# EAGLE design TAStm32_v4 (EAGLE 9.6.2)
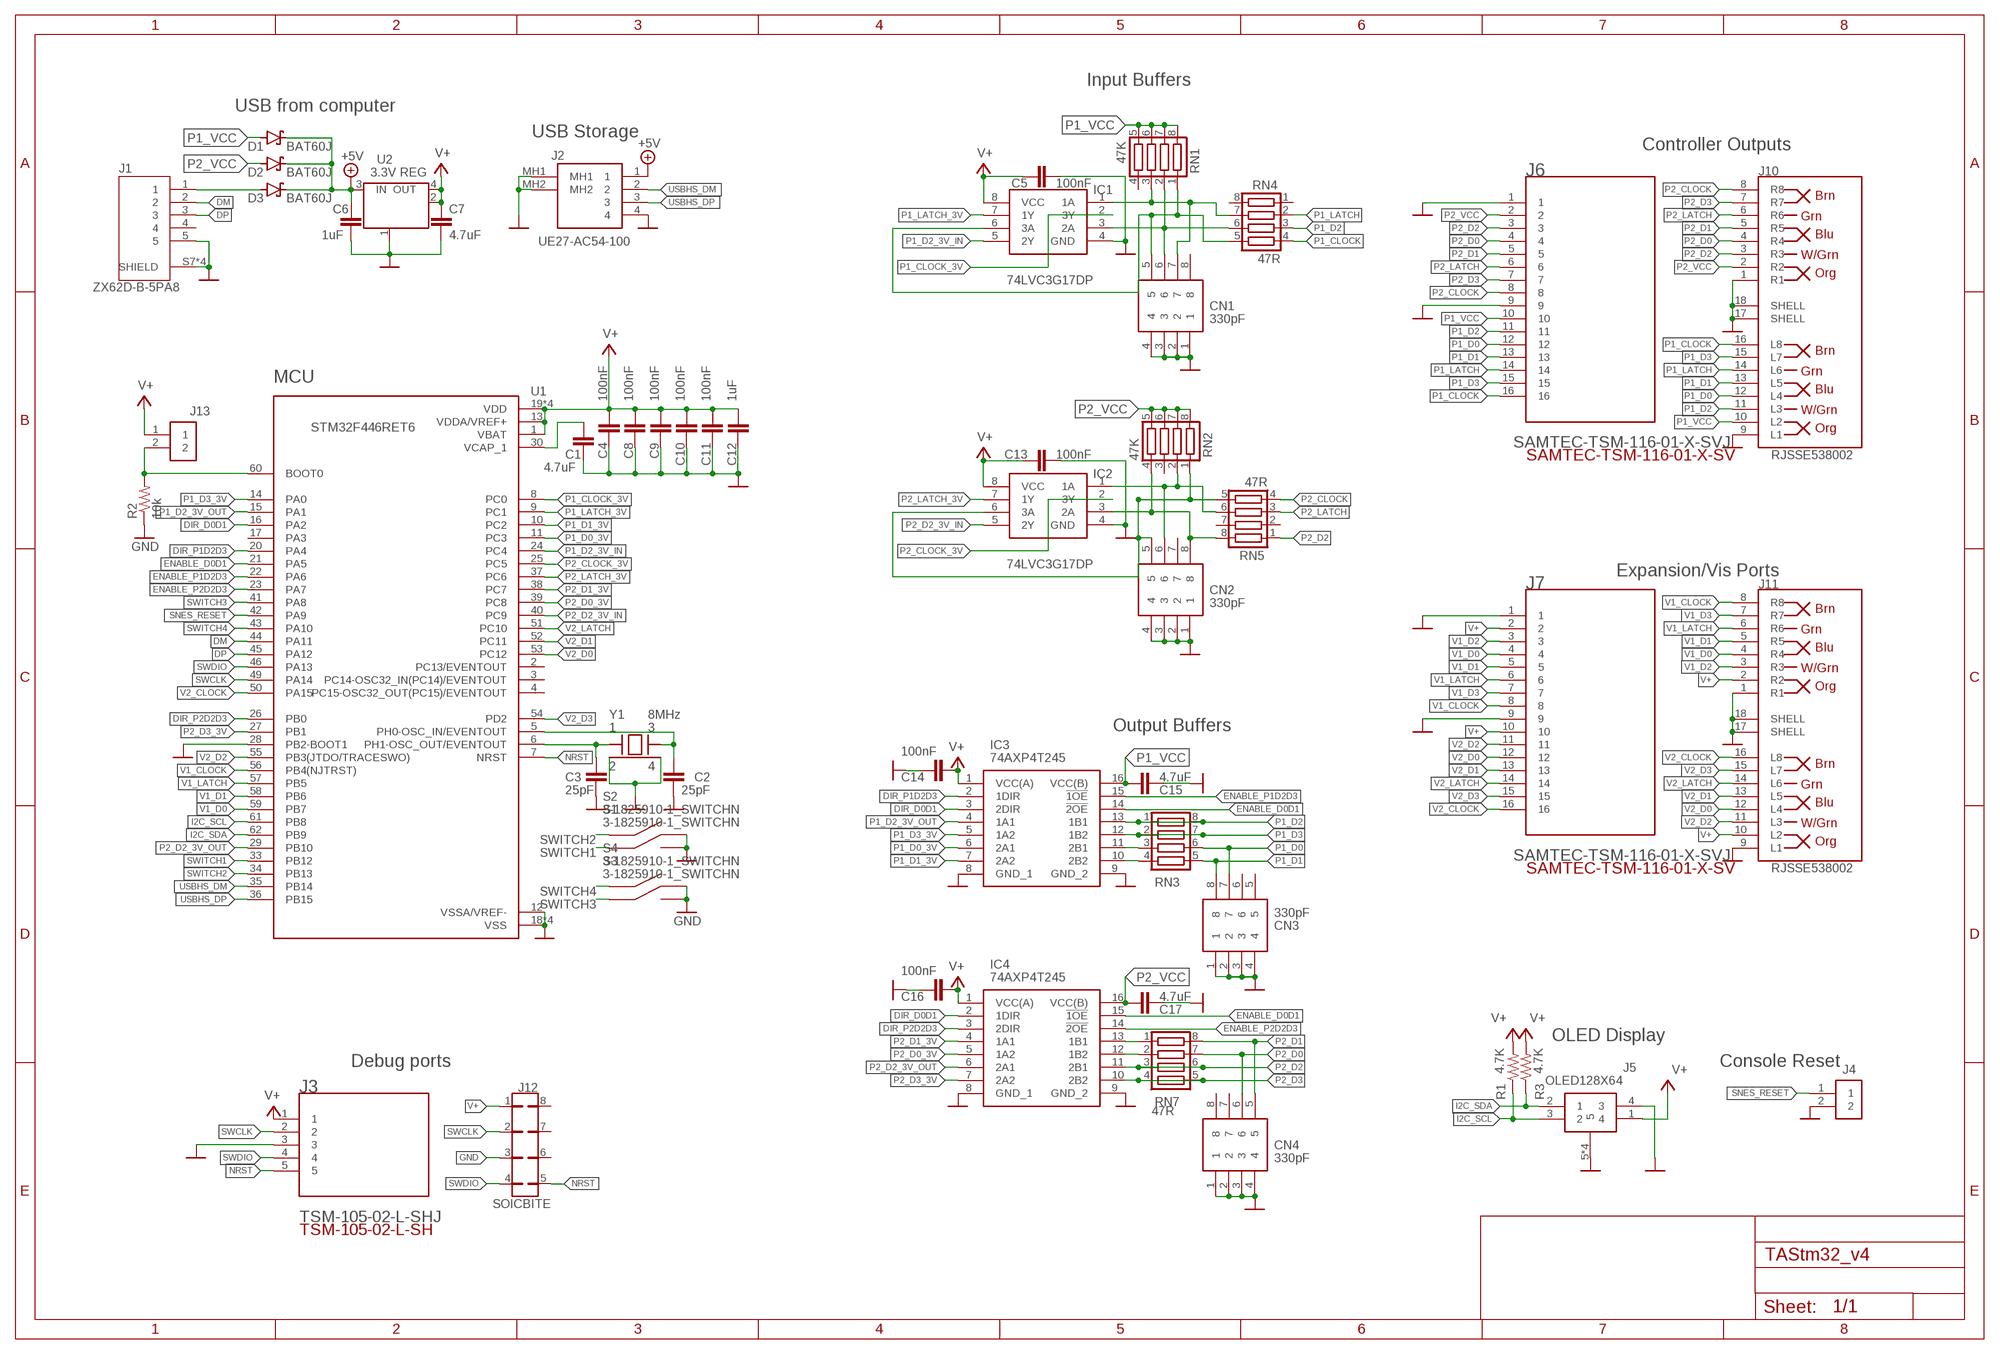
[diagram p0: schematic, sheet 1]

## Parts
C1  4.7uF  C-EUC0603K  [C0603K]
C2  25pF  C-EUC0603K  [C0603K]
C3  25pF  C-EUC0603K  [C0603K]
C4  100nF  C-EUC0603K  [C0603K]
C5  100nF  C-EUC0603K  [C0603K]
C6  1uF  C-EUC0603K  [C0603K]
C7  4.7uF  C-EUC0603K  [C0603K]
C8  100nF  C-EUC0603K  [C0603K]
C9  100nF  C-EUC0603K  [C0603K]
C10  100nF  C-EUC0603K  [C0603K]
C11  100nF  C-EUC0603K  [C0603K]
C12  1uF  C-EUC0603K  [C0603K]
C13  100nF  C-EUC0603K  [C0603K]
C14  100nF  C-EUC0603K  [C0603K]
C15  4.7uF  C-EUC0603K  [C0603K]
C16  100nF  C-EUC0603K  [C0603K]
C17  4.7uF  C-EUC0603K  [C0603K]
CN1  330pF  CA0612KRX7R7BB104  [CA0612KRX7R7BB104]
CN2  330pF  CA0612KRX7R7BB104  [CA0612KRX7R7BB104]
CN3  330pF  CA0612KRX7R7BB104  [CA0612KRX7R7BB104]
CN4  330pF  CA0612KRX7R7BB104  [CA0612KRX7R7BB104]
D1  BAT60J  DIODE_BAT60J  [DIODE_SOD323_ST]
D2  BAT60J  DIODE_BAT60J  [DIODE_SOD323_ST]
D3  BAT60J  DIODE_BAT60J  [DIODE_SOD323_ST]
IC1  74LVC3G17DP  74HCT3G07DP-Q100H  [SOP65P400X110-8N]
IC2  74LVC3G17DP  74HCT3G07DP-Q100H  [SOP65P400X110-8N]
IC3  74AXP4T245  74AVCH4T245PW,118  [SOP65P640X110-16N]
IC4  74AXP4T245  74AVCH4T245PW,118  [SOP65P640X110-16N]
J1  ZX62D-B-5PA8  [HIROSE_ZX62D-B-5PA8]
J2  UE27-AC54-100  [UE27AC54100]
J3  TSM-105-02-L-SHJ  [TSM-105-02-L-SH]
J4  CONSOLE_RESET  SAMTEC-TSM-102-01-X-SH_SAMTEC-TSM-102-01-X-SH  [SAMTEC-TSM-102-01-X-SH]
J5  OLED128X64  [OLED]
J6  SAMTEC-TSM-116-01-X-SVJ  [SAMTEC-TSM-116-01-X-SV]
J7  SAMTEC-TSM-116-01-X-SVJ  [SAMTEC-TSM-116-01-X-SV]
J10  RJSSE538002  RJSSE538002_RJSSE538002  [AMPHENOL_RJSSE538002]
J11  RJSSE538002  RJSSE538002_RJSSE538002  [AMPHENOL_RJSSE538002]
J12  SOICBITE  [SOICBITE]
J13  CONSOLE_RESET  SAMTEC-TSM-102-01-X-SH_SAMTEC-TSM-102-01-X-SH  [SAMTEC-TSM-102-01-X-SH]
R1  4.7K  R-US_R0805  [R0805]
R2  10k  R-US_R0805  [R0805]
R3  4.7K  R-US_R0805  [R0805]
RN1  47K  CTS742C083  [CTS742C083]
RN2  47K  CTS742C083  [CTS742C083]
RN3  CTS742C083  [CTS742C083]
RN4  47R  CTS742C083  [CTS742C083]
RN5  47R  CTS742C083  [CTS742C083]
RN7  47R  CTS742C083  [CTS742C083]
S1  3-1825910-1_SWITCHN  [3-1825910-1_318259101]
S2  3-1825910-1_SWITCHN  [3-1825910-1_318259101]
S3  3-1825910-1_SWITCHN  [3-1825910-1_318259101]
S4  3-1825910-1_SWITCHN  [3-1825910-1_318259101]
U1  STM32F446RET6  STM32F446RET7  [QFP50P1200X1200X160-64N]
U2  3.3V REG  MC33269ST-3.3T3  [SOT223]
Y1  8MHz  ABMM-8.000MHZ-B2-T_ABMM-8.000MHZ-B2-T  [DFN-4]

## Nets
+5V [power]: C6.2 D1.C D2.C D3.C J2.1 U2.3(IN)
BOOT0: J13.2 R2.2 U1.60(BOOT0)
DIR_D0D1: IC3.3(2DIR) IC4.2(1DIR) U1.16(PA2)
DIR_P1D2D3: IC3.2(1DIR) U1.20(PA4)
DIR_P2D2D3: IC4.3(2DIR) U1.26(PB0)
DM [USB]: J1.2 U1.44(PA11)
DP [USB]: J1.3 U1.45(PA12)
ENABLE_D0D1: IC3.14(!2OE) IC4.15(!1OE) U1.21(PA5)
ENABLE_P1D2D3: IC3.15(!1OE) U1.22(PA6)
ENABLE_P2D2D3: IC4.14(!2OE) U1.23(PA7)
GND: C1.2 C2.1 C3.1 C4.1 C5.2 C6.1 C7.1 C8.1 C9.1 C10.1 C11.1 C12.1 C13.2 C14.1 C15.2 C16.1 C17.2 CN1.1 CN1.2 CN1.3 CN1.4 CN2.1 CN2.2 CN2.3 CN2.4 CN3.1 CN3.2 CN3.3 CN3.4 CN4.1 CN4.2 CN4.3 CN4.4 IC1.4(GND) IC2.4(GND) IC3.8(GND_1) IC3.9(GND_2) IC4.8(GND_1) IC4.9(GND_2) J1.5 J1.S7(SHIELD) J1.S8(SHIELD) J1.S9(SHIELD) J1.S10(SHIELD) J2.4 J2.MH1 J2.MH2 J3.3 J4.2 J5.4 J5.5 J5.6 J5.7 J5.8 J6.1 J6.9 J7.1 J7.9 J10.1(R1) J10.9(L1) J10.17(SHELL) J10.18(SHELL) J11.1(R1) J11.9(L1) J11.17(SHELL) J11.18(SHELL) J12.3 R2.1 S1.3 S1.4 S2.3 S2.4 S3.3 S3.4 S4.3 S4.4 U1.12(VSSA/VREF-) U1.18(VSS) U1.28(PB2-BOOT1) U1.31(VSS) U1.47(VSS) U1.63(VSS) U2.1(GND/ADJ) Y1.2 Y1.4
I2C_SCL: J5.3 R1.1 U1.61(PB8)
I2C_SDA: J5.2 R3.1 U1.62(PB9)
N$1: D3.A J1.1
N$4: CN2.6 IC2.1(1A) RN2.2 RN5.6
N$5: C3.2 U1.6(PH1-OSC_OUT/EVENTOUT) Y1.1
N$6: CN2.5 IC2.6(3A) RN2.1 RN5.5
N$8: CN2.8 IC2.3(2A) RN2.4 RN5.8
N$9: IC3.11(2B1) RN3.3
N$10: IC3.10(2B2) RN3.4
N$11: IC4.12(1B2) RN7.2
N$12: IC4.13(1B1) RN7.1
N$16: CN1.7 IC1.1(1A) RN1.3 RN4.7
N$17: CN1.5 IC1.6(3A) RN1.1 RN4.5
N$18: CN1.6 IC1.3(2A) RN1.2 RN4.6
NRST: J3.5 J12.5 U1.7(NRST)
P1_CLOCK: J6.16 J10.16(L8) RN4.4
P1_CLOCK_3V: IC1.2(3Y) U1.8(PC0)
P1_D0: CN3.7 J6.12 J10.12(L4) RN3.6
P1_D0_3V: IC3.6(2A1) U1.11(PC3)
P1_D1: CN3.8 J6.13 J10.13(L5) RN3.5
P1_D1_3V: IC3.7(2A2) U1.10(PC2)
P1_D2: IC3.13(1B1) J6.11 J10.11(L3) RN3.1 RN3.8 RN4.3
P1_D2_3V_IN: IC1.5(2Y) U1.24(PC4)
P1_D2_3V_OUT: IC3.4(1A1) U1.15(PA1)
P1_D3: IC3.12(1B2) J6.15 J10.15(L7) RN3.2 RN3.7
P1_D3_3V: IC3.5(1A2) U1.14(PA0)
P1_LATCH: J6.14 J10.14(L6) RN4.2
P1_LATCH_3V: IC1.7(1Y) U1.9(PC1)
P1_VCC [power]: C15.1 D1.A IC3.16(VCC(B)) J6.10 J10.10(L2) RN1.5 RN1.6 RN1.7 RN1.8
P2_CLOCK: J6.8 J10.8(R8) RN5.4
P2_CLOCK_3V: IC2.2(3Y) U1.25(PC5)
P2_D0: CN4.6 J6.4 J10.4(R4) RN7.7
P2_D0_3V: IC4.5(1A2) U1.39(PC8)
P2_D1: CN4.5 J6.5 J10.5(R5) RN7.8
P2_D1_3V: IC4.4(1A1) U1.38(PC7)
P2_D2: IC4.11(2B1) J6.3 J10.3(R3) RN5.1 RN7.3 RN7.6
P2_D2_3V_IN: IC2.5(2Y) U1.40(PC9)
P2_D2_3V_OUT: IC4.6(2A1) U1.29(PB10)
P2_D3: IC4.10(2B2) J6.7 J10.7(R7) RN7.4 RN7.5
P2_D3_3V: IC4.7(2A2) U1.27(PB1)
P2_LATCH: J6.6 J10.6(R6) RN5.3
P2_LATCH_3V: IC2.7(1Y) U1.37(PC6)
P2_VCC [power]: C17.1 D2.A IC4.16(VCC(B)) J6.2 J10.2(R2) RN2.5 RN2.6 RN2.7 RN2.8
SNES_RESET: J4.1 U1.42(PA9)
SWCLK: J3.2 J12.2 U1.49(PA14)
SWDIO: J3.4 J12.4 U1.46(PA13)
SWITCH1: S1.1 S1.2 U1.33(PB12)
SWITCH2: S2.1 S2.2 U1.34(PB13)
SWITCH3: S3.1 S3.2 U1.41(PA8)
SWITCH4: S4.1 S4.2 U1.43(PA10)
USBHS_DM [USB]: J2.2 U1.35(PB14)
USBHS_DP [USB]: J2.3 U1.36(PB15)
V1_CLOCK: J7.8 J11.8(R8) U1.56(PB4(NJTRST))
V1_D0: J7.4 J11.4(R4) U1.59(PB7)
V1_D1: J7.5 J11.5(R5) U1.58(PB6)
V1_D2: J7.3 J11.3(R3)
V1_D3: J7.7 J11.7(R7)
V1_LATCH: J7.6 J11.6(R6) U1.57(PB5)
V2_CLOCK: J7.16 J11.16(L8) U1.50(PA15)
V2_D0: J7.12 J11.12(L4) U1.53(PC12)
V2_D1: J7.13 J11.13(L5) U1.52(PC11)
V2_D2: J7.11 J11.11(L3) U1.55(PB3(JTDO/TRACESWO))
V2_D3: J7.15 J11.15(L7) U1.54(PD2)
V2_LATCH: J7.14 J11.14(L6) U1.51(PC10)
V+ [power]: C4.2 C5.1 C7.2 C8.2 C9.2 C10.2 C11.2 C12.2 C13.1 C14.2 C16.2 IC1.8(VCC) IC2.8(VCC) IC3.1(VCC(A)) IC4.1(VCC(A)) J3.1 J5.1 J7.2 J7.10 J11.2(R2) J11.10(L2) J12.1 J13.1 R1.2 R3.2 U1.1(VBAT) U1.13(VDDA/VREF+) U1.19(VDD) U1.32(VDD) U1.48(VDD) U1.64(VDD) U2.2(OUT) U2.4(OUT)
VCAP: C1.1 U1.30(VCAP_1)
XTAL1: C2.2 U1.5(PH0-OSC_IN/EVENTOUT) Y1.3
Unconnected: CN1.8 CN2.7 CN3.5 CN3.6 CN4.7 CN4.8 J1.4 J12.6 J12.7 J12.8 RN1.4 RN2.3 RN4.1 RN4.8 RN5.2 RN5.7 U1.2(PC13/EVENTOUT) U1.3(PC14-OSC32_IN(PC14)/EVENTOUT) U1.4(PC15-OSC32_OUT(PC15)/EVENTOUT) U1.17(PA3)

## Notes on the sheet
- Input Buffers
- USB from computer
- USB Storage
- Controller Outputs
- MCU
- Expansion/Vis Ports
- Output Buffers
- OLED Display
- Debug ports | Console Reset

## Library data of the parts
C1-C17 = rcl:C-EU: CAPACITOR, European symbol; SPICEPREFIX: C
CN1-CN4 = SamacSys_Parts:CA0612KRX7R7BB104: Phycomp Capacitor Array 100nF 16V dc +/-10% 4-way X7R Dielectric 0612 (1632M) Package C-Array Series Surface Mount Source: Datasheet; DESCRIPTION: Phycomp Capacitor Array 100nF 16V dc +/-10% 4-way X7R Dielectric 0612 (1632M) Package C-Array Series Surface Mount; HEIGHT: 0mm; MANUFACTURER_NAME: YAGEO (PHYCOMP); MANUFACTURER_PART_NUMBER: CA0612KRX7R7BB104; MOUSER_PART_NUMBER: 603-CA612KRX7R7BB104; MOUSER_PRICE-STOCK: https://www.mouser.co.uk/ProductDetail/Yageo/CA0612KRX7R7BB104/?qs=AJwqpy2c0%252B9CH0DBF0MBBw%3D%3D
D1-D3 = TAStm32_v4:DIODE_BAT60J: Schottky barrier diode Source: www.st.com, BAT60J.pdf
IC1 IC2 = SamacSys_Parts:74HCT3G07DP-Q100H: 74HC(T)3G07-Q100 - Triple buffer with open-drain outputs@en-us Source: Datasheet; DESCRIPTION: 74HC(T)3G07-Q100 - Triple buffer with open-drain outputs@en-us; HEIGHT: 1.1mm; MANUFACTURER_NAME: Nexperia; MANUFACTURER_PART_NUMBER: 74HCT3G07DP-Q100H; RS_PART_NUMBER: 1532947P; RS_PRICE-STOCK: http://uk.rs-online.com/web/p/products/1532947P
IC3 IC4 = SamacSys_Parts:74AVCH4T245PW,118: 74AVCH4T245 - 4-bit dual supply translating transceiver with configurable voltage translation; 3-state@en-us Source: Datasheet; DESCRIPTION: 74AVCH4T245 - 4-bit dual supply translating transceiver with configurable voltage translation; 3-state@en-us; HEIGHT: 1.1mm; MANUFACTURER_NAME: Nexperia; MANUFACTURER_PART_NUMBER: 74AVCH4T245PW,118; MOUSER_PART_NUMBER: 771-74AVCH4T245PW118; MOUSER_PRICE-STOCK: http://www.mouser.com/Search/ProductDetail.aspx?qs=jquClx72t9DzXyE70aWLyQ%3d%3d
J1 = ZX62D-B-5PA8:ZX62D-B-5PA8: CONN RCPT USB; AVAILABILITY: Unavailable; DESCRIPTION: 5 Pin Single Port USB 2.0 Micro B Bottom Mount Through Hole Receptacle Male; MF: Hirose; MP: ZX62D-B-5PA8; PACKAGE: None; PRICE: None
J2 = SamacSys_Parts:UE27-AC54-100: USB Connectors 4P R/A PCB Recpt Source: Datasheet; DESCRIPTION: USB Connectors 4P R/A PCB Recpt; HEIGHT: 6.9mm; MANUFACTURER_NAME: Amphenol; MANUFACTURER_PART_NUMBER: UE27-AC54-100; MOUSER_PART_NUMBER: 523-UE27-AC54-100; MOUSER_PRICE-STOCK: https://www.mouser.co.uk/ProductDetail/Amphenol-Commercial-Products/UE27-AC54-100?qs=rJxDu3iMzY11Oq3QSy%252BXOA%3D%3D
J3 = TSM-105-02-L-SH:TSM-105-02-L-SH: Check prices; AVAILABILITY: Bad; DESCRIPTION: Connector Header Surface Mount, Right Angle 5 position 0.100 (2.54mm); MF: Samtec; MP: TSM-105-02-L-SH; PACKAGE: None; PRICE: None; PURCHASE-URL: https://pricing.snapeda.com/search/part/TSM-105-02-L-SH/?ref=eda
J4 J13 = TAStm32_v4:SAMTEC-TSM-102-01-X-SH_SAMTEC-TSM-102-01-X-SH
J5 = TAStm32_v4:OLED128X64
J6 J7 = SAMTEC-TSM-116-01-X-SV:SAMTEC-TSM-116-01-X-SV
J10 J11 = TAStm32_v4:RJSSE538002_RJSSE538002: Conn RJ-45 F 16 POS 1.27mm Solder RA SMD 16 Terminal 2 Port Cat 5
J12 = SOICbite_Eagle:SOICBITE: SOICbite footprint Allows for direct clipping of a SOIC-8 Testclip onto a PCB edge for Programming/Debugging purposes without extra components. Original footprint created by: Simon Merrit Adapted to Eagle by: Chiel Voswijk (Foxhood) NOTE: Footprint is to be used on the edge of a PCB and may require the use of thin traces for accessing the inner pads. This may violate some Design Rules! One can often ignore these, but understand working is NOT guaranteed.
R1-R3 = rcl:R-US_: RESISTOR, American symbol; SPICEPREFIX: R
RN1-RN5 RN7 = resistor-net:CTS742C083: Chip Resistor Array 4 Single Resistor Source: http://www.ctscorp.com/components/Datasheets/CTSChipArrayDs.pdf; OC_FARNELL: unknown; OC_NEWARK: unknown
S1-S4 = TAStm32_v4:3-1825910-1_SWITCHN
U1 = STM32F446RET6:STM32F446RET7
U2 = linear:MC33269ST*: Adjustable Output Low Dropout Voltage Regulator 800 mA Source: http://www.onsemi.com/pub/Collateral/MC33269-D.PDF
Y1 = TAStm32_v4:ABMM-8.000MHZ-B2-T_ABMM-8.000MHZ-B2-T: CRYSTAL 24MHZ 18PF SMD

## Net classes
1 USB: width 0.254 mm, clearance 0.152 mm

## Board
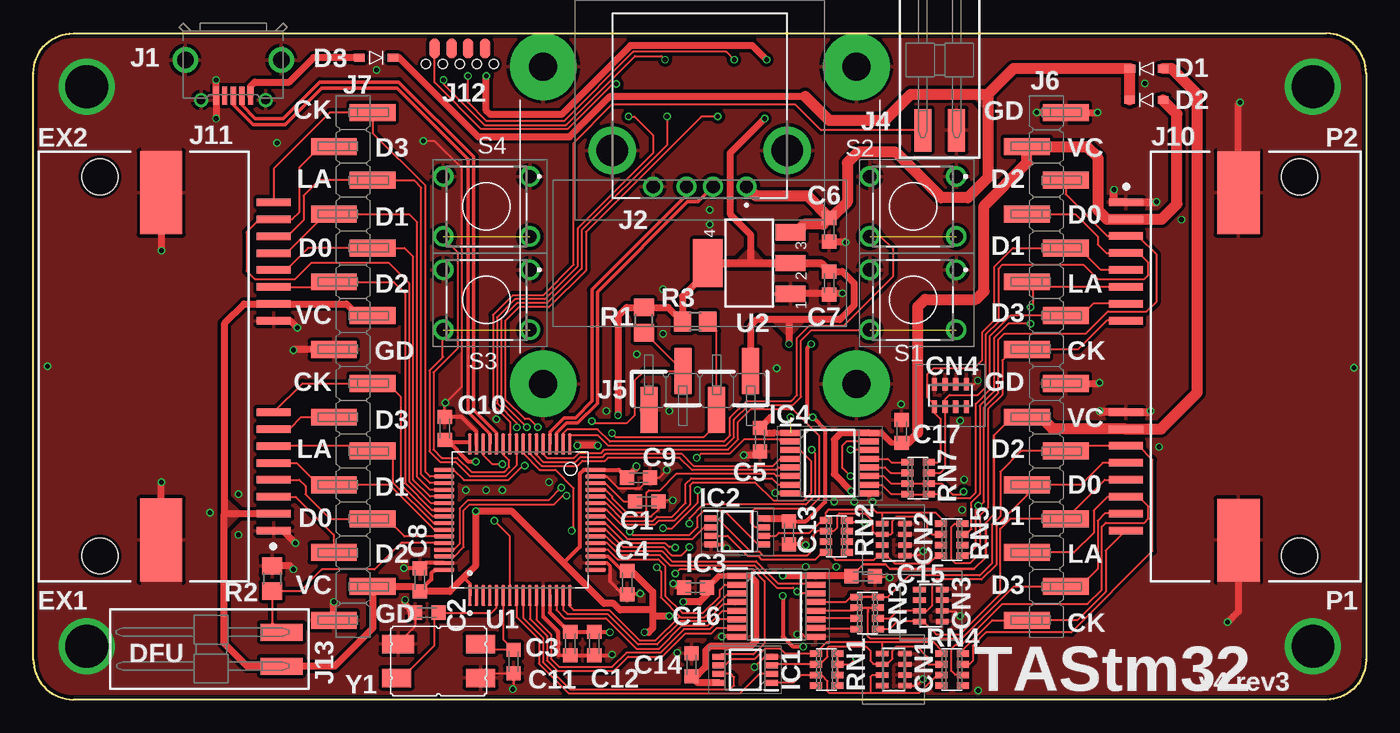
[diagram p1: board, top side]
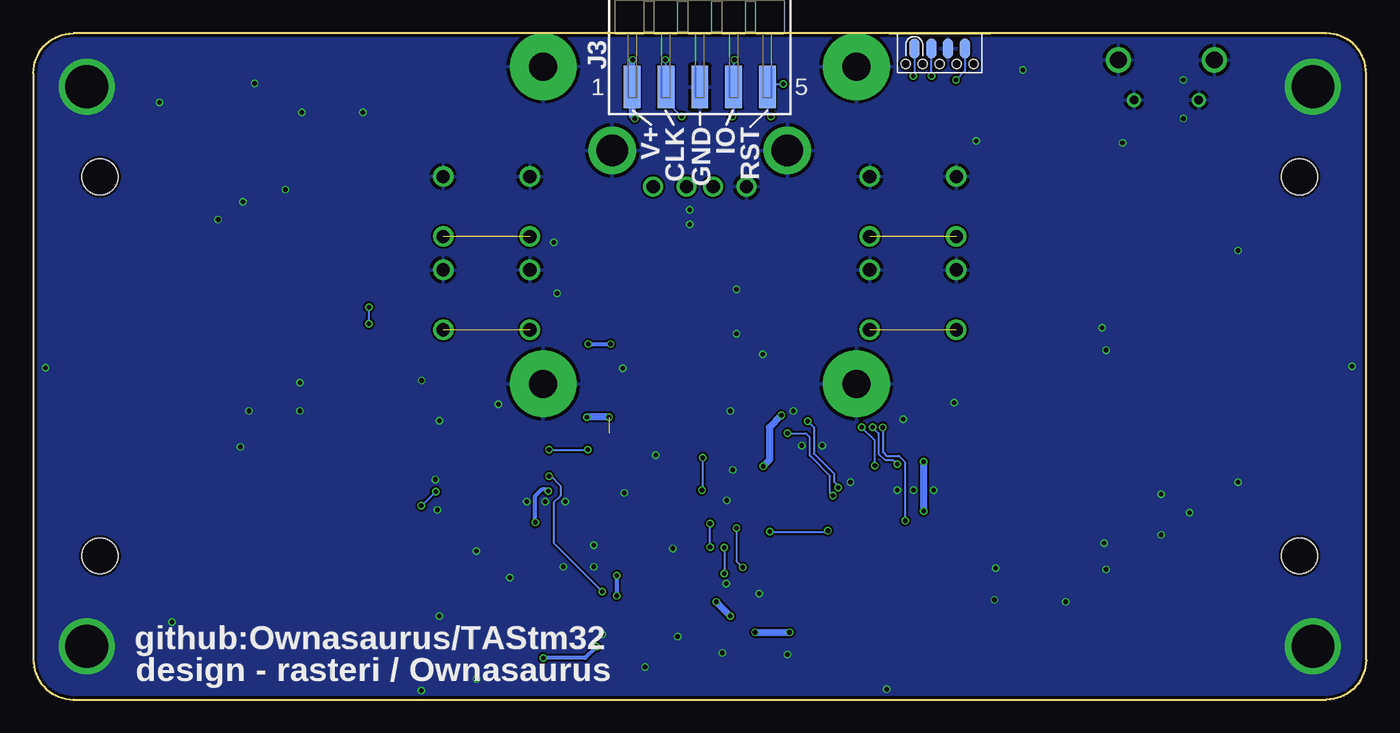
[diagram p2: board, bottom side, seen from below]

Size 100 x 50 mm. Coordinates in mm from the lower left corner, seen from the top.
Outline: 3,50 97,50 arc-90 100,47 100,3 arc-90 97,0 3,0 arc-90 0,3 0,47 arc-90 3,50
Copper layers (1*16): Top 0.035mm / dielectric 1.53mm / Bottom 0.035mm
Design rules "circuithub-minimum-design-rules-with-tented-vias *": minimum track width 3mil, minimum drill 0.15mm, track to track 6mil, track to pad 6mil, pad to pad 6mil, via to via 6mil, smd to smd 0mil, copper to edge 8mil, drill to drill 8mil, minimum pad ring 4mil, minimum via ring 4mil, stop-mask expansion 4mil, vias tented up to drill 25mil, thermal gap 10mil

### Footprints (pad centres in the part's own frame; a part is rotated, then mirrored left to right if it is on the bottom)
C0603K = smd 1.05 x 1.08: 1 -0.875,0; 2 0.875,0
CA0612KRX7R7BB104 = smd 0.95 x 0.4: 1 -0.85,1.2; 2 -0.85,0.4; 3 -0.85,-0.4; 4 -0.85,-1.2; 5 0.85,-1.2; 6 0.85,-0.4; 7 0.85,0.4; 8 0.85,1.2
DIODE_SOD323_ST = smd 0.8 x 0.6: A 1.25,0; C -1.25,0
SOP65P400X110-8N = smd 0.95 x 0.45: 1 -1.975,0.975; 2 -1.975,0.325; 3 -1.975,-0.325; 4 -1.975,-0.975; 5 1.975,-0.975; 6 1.975,-0.325; 7 1.975,0.325; 8 1.975,0.975
SOP65P640X110-16N = smd 1.475 x 0.45: 1 -2.938,2.275; 2 -2.938,1.625; 3 -2.938,0.975; 4 -2.938,0.325; 5 -2.938,-0.325; 6 -2.938,-0.975; 7 -2.938,-1.625; 8 -2.938,-2.275; 9 2.938,-2.275; 10 2.938,-1.625; 11 2.938,-0.975; 12 2.938,-0.325; 13 2.938,0.325; 14 2.938,0.975; 15 2.938,1.625; 16 2.938,2.275
HIROSE_ZX62D-B-5PA8 = smd 1.35 x 0.4: 1 2.675,1.3; 2 2.675,0.65; 3 2.675,0; 4 2.675,-0.65; 5 2.675,-1.3 | drill 0.65 pad 1.05: S7 3,2.425; S8 3,-2.425 | drill 1.25 pad 1.9: S9 0,3.6; S10 0,-3.6
UE27AC54100 = drill 1 pad 1.5: 1 -3.5,0; 2 -1,0; 3 1,0; 4 3.5,0 | drill 2.38 pad 3.57: MH1 -6.57,-2.71; MH2 6.57,-2.71
TSM-105-02-L-SH = smd 1.27 x 3.18: 1 -5.08,-5.283; 2 -2.54,-5.283; 3 0,-5.283; 4 2.54,-5.283; 5 5.08,-5.283
SAMTEC-TSM-102-01-X-SH = smd 1.27 x 3.18: 1 -1.27,-5.283; 2 1.27,-5.283
OLED = smd 1.27 x 3.43: 1 -3.81,8.84; 2 -1.27,11.76; 3 1.27,8.84; 4 3.81,11.76 | drill 2.1 pad 5: 5 -11.75,9.8; 6 11.75,9.8; 7 -11.75,-14; 8 11.75,-14
SAMTEC-TSM-116-01-X-SV = smd 1.27 x 3.43: 1 -19.05,1.46; 2 -16.51,-1.46; 3 -13.97,1.46; 4 -11.43,-1.46; 5 -8.89,1.46; 6 -6.35,-1.46; 7 -3.81,1.46; 8 -1.27,-1.46; 9 1.27,1.46; 10 3.81,-1.46; 11 6.35,1.46; 12 8.89,-1.46; 13 11.43,1.46; 14 13.97,-1.46; 15 16.51,1.46; 16 19.05,-1.46
AMPHENOL_RJSSE538002 = smd 0.56 x 2.54: 1 12.325,13.04; 2 11.055,13.04; 3 9.785,13.04; 4 8.515,13.04; 5 7.245,13.04; 6 5.975,13.04; 7 4.705,13.04; 8 3.435,13.04; 9 -3.425,13.04; 10 -4.695,13.04; 11 -5.965,13.04; 12 -7.235,13.04; 13 -8.505,13.04; 14 -9.775,13.04; 15 -11.045,13.04; 16 -12.315,13.04 | smd 6.22 x 3.18: 17 -13.035,4.59; 18 13.025,4.59 | hole 2.69: -14.225,0; 14.225,0
SOICBITE = smd 0.8 x 1.5: 1 1.905,0.75; 2 0.635,0.75; 3 -0.635,0.75; 4 -1.905,0.75 | smd 0.8 x 1.5 bottom: 5 -1.905,0.75; 6 -0.635,0.75; 7 0.635,0.75; 8 1.905,0.75 | hole 0.7: -2.54,1.905; -1.27,1.905; 0,1.905; 1.27,1.905; 2.54,1.905
R0805 = smd 1.3 x 1.5: 1 -0.95,0; 2 0.95,0
CTS742C083 = smd 0.5 x 0.9: 1 -1.2,-0.8; 2 -0.4,-0.8; 3 0.4,-0.8; 4 1.2,-0.8; 5 1.2,0.8; 6 0.4,0.8; 7 -0.4,0.8; 8 -1.2,0.8
3-1825910-1_318259101 = drill 0.99 pad 1.54: 1 3.25,-2.25; 2 -3.25,-2.25; 3 3.25,2.25; 4 -3.25,2.25
QFP50P1200X1200X160-64N = smd 1.56 x 0.28: 1 -5.68,3.75; 2 -5.68,3.25; 3 -5.68,2.75; 4 -5.68,2.25; 5 -5.68,1.75; 6 -5.68,1.25; 7 -5.68,0.75; 8 -5.68,0.25; 9 -5.68,-0.25; 10 -5.68,-0.75; 11 -5.68,-1.25; 12 -5.68,-1.75; 13 -5.68,-2.25; 14 -5.68,-2.75; 15 -5.68,-3.25; 16 -5.68,-3.75; 33 5.68,-3.75; 34 5.68,-3.25; 35 5.68,-2.75; 36 5.68,-2.25; 37 5.68,-1.75; 38 5.68,-1.25; 39 5.68,-0.75; 40 5.68,-0.25; 41 5.68,0.25; 42 5.68,0.75; 43 5.68,1.25; 44 5.68,1.75; 45 5.68,2.25; 46 5.68,2.75; 47 5.68,3.25; 48 5.68,3.75 | smd 0.28 x 1.56: 17 -3.75,-5.68; 18 -3.25,-5.68; 19 -2.75,-5.68; 20 -2.25,-5.68; 21 -1.75,-5.68; 22 -1.25,-5.68; 23 -0.75,-5.68; 24 -0.25,-5.68; 25 0.25,-5.68; 26 0.75,-5.68; 27 1.25,-5.68; 28 1.75,-5.68; 29 2.25,-5.68; 30 2.75,-5.68; 31 3.25,-5.68; 32 3.75,-5.68; 49 3.75,5.68; 50 3.25,5.68; 51 2.75,5.68; 52 2.25,5.68; 53 1.75,5.68; 54 1.25,5.68; 55 0.75,5.68; 56 0.25,5.68; 57 -0.25,5.68; 58 -0.75,5.68; 59 -1.25,5.68; 60 -1.75,5.68; 61 -2.25,5.68; 62 -2.75,5.68; 63 -3.25,5.68; 64 -3.75,5.68
SOT223 = smd 1.219 x 2.235: 1 -2.311,-3.099; 2 0,-3.099; 3 2.311,-3.099 | smd 3.6 x 2.2: 4 0,3.099
DFN-4 = smd 2.2 x 1.4: 1 0.45,1.32; 2 0.45,3.87; 3 6.75,3.87 | smd 2.4 x 1.4: 4 6.65,1.32

### Placement (x,y rotation side)
C1  46.02,14.87 0 top
C2  29.53,6.52 0 top
C3  36.03,2.84 90 top
C4  44.55,8.78 90 top
C5  54.52,19.51 270 top
C6  59.71,35.25 90 top
C7  59.71,31.25 90 top
C8  29,8.98 270 top
C9  45.4,16.65 180 top
C10  30.87,20.34 270 top
C11  40.29,4.2 90 top
C12  42.1,4.2 90 top
C13  56.69,12.51 270 top
C14  49.38,2.6 270 top
C15  62.25,9.25 0 top
C16  49.68,8.39 0 top
C17  65.15,20.12 90 top
CN1  64.54,2.25 180 top
CN2  64.54,12 180 top
CN3  67.33,7.05 180 top
CN4  68.8,22.82 270 top
D1  83.52,47.35 0 top
D2  83.5,45 0 top
D3  25.72,48.17 180 top
IC1  53.41,2.25 180 top
IC2  52.82,12.61 0 top
IC3  55.75,7 0 top
IC4  59.75,17.75 0 top
J1  15,48 270 top
J2  50,38.5 180 top
J3  50,51.25 0 bottom
J4  68,48 0 top
J5  50,33.5 180 top
J6  76,25 270 top
J7  24,25 90 top
J10  95,25 90 top
J11  5,25 270 top
J12  32,49.6 180 bottom
J13  13.35,3.78 90 top
R1  45.82,28.48 90 top
R2  17.9,9.08 270 top
R3  49.65,28.35 180 top
RN1  59.52,2.25 270 top
RN2  60.25,12.25 270 top
RN3  62.57,6.5 270 top
RN4  68.93,2.25 90 top
RN5  68.9,12 90 top
RN7  66.38,16.61 270 top
S1  66,30 0 top
S2  66,37 0 top
S3  34,30 0 top
S4  34,37 0 top
U1  36.5,13.49 90 top
U2  53.71,32.75 90 top
Y1  34,5.49 180 top

### Tracks (layer width: path | path; a pad name or v marks a point on that pad's centre or on a via)
+5V
  Top 0.508: D3.C 27.43,48.17 33.38,42.23 40.23,42.23 43.28,45.28 57.91,45.28 | 59.73,36.15 C6.2
  Top 0.61: 82.25,47.33 D1.C | 59.86,36.13 C6.2 59.25,35.67 | U2.3 57.27,35.06
  Top 0.813: D2.C 82.25,47.33 | D1.C 73.55,47.35 71.63,45.43 | 59.86,36.13 61.07,37.34 61.07,40.28 61.85,41.06 64.72,41.06 68.12,37.66 70.1,37.66 71.63,39.18 71.63,45.43 | 57.27,35.06 57.87,35.67 59.25,35.67 | J2.1 54.19,37.81 58.06,37.81 59.73,36.15 | 57.91,45.28 59.71,43.48 63.89,43.48 65.84,45.43 71.63,45.43
  pour Top (no thermals): 71.63,45.43 71.63,44.21 70.41,45.43
BOOT0
  Top 0.152: U1.60 27.58,11.74 25.6,9.77 21.64,9.77 20.01,8.13 R2.2 17.9,5.78 J13.2
DIR_D0D1  (via drill 0.35)
  Top 0.152: U1.16 40.25,6.99 40.52,6.72 43.21,6.72 45.5,4.43 46.67,4.43 48.43,6.18 48.57,6.18 | IC4.2 56.11,19.38 55.97,19.51 53.31,19.51 52.25,18.44 50.08,18.44 v49.78,18.14 | v46.79,9.92 47.09,9.61 47.09,7.66 48.57,6.18 | IC3.3 52.16,7.97 50.37,6.18 48.57,6.18 | v47.24,12.86 47.94,12.86 49.84,14.76 v49.84,15.71
  Bottom 0.152: v49.78,18.14 49.78,15.71 v49.84,15.71 | v47.24,12.86 47.24,10.38 v46.79,9.92
DIR_P1D2D3
  Top 0.152: U1.20 43.12,11.24 43.84,10.53 46.9,10.53 47.4,10.03 47.4,7.79 48.69,6.49 50.24,6.49 51.51,7.76 51.51,8.24 51.89,8.62 IC3.2
DIR_P2D2D3
  Top 0.152: U1.26 43.02,14.24 44.14,13.12 46.62,13.12 46.91,13.41 48.05,13.41 49.25,14.61 49.25,16.06 49.5,16.31 54.16,16.31 55.52,14.95 57.8,14.95 58.37,15.52 58.37,17.87 57.52,18.73 IC4.3
DM
  Top 0.254: J1.2 15.65,44.6 16.65,43.6 18.75,43.6 21.49,46.34 27.42,46.34 33.03,40.73 33.03,21.74 34.75,20.02 U1.44
DP
  Top 0.254: J1.3 15,44.63 16.49,43.14 18.9,43.14 21.64,45.88 27.3,45.88 32.63,40.56 32.63,21.57 34.27,19.93 34.27,19.19 U1.45
ENABLE_D0D1  (via drill 0.35)
  Top 0.152: U1.21 43.05,11.74 43.96,10.83 47.02,10.83 47.79,10.07 54.1,10.07 55.79,8.38 57.01,8.38 v57.3,8.09 57.42,7.97 IC3.14 | IC4.15 61.02,19.38 60.7,19.05 60.7,17.37 v61.31,16.77
  Bottom 0.152: v61.31,16.77 61.17,16.77 60.45,16.05 60.45,15.29 60.96,14.78 60.96,11.75 60.45,11.24 60.42,11.21 v57.3,8.09
ENABLE_P1D2D3
  Top 0.152: U1.22 42.98,12.24 44.09,11.14 47.15,11.14 47.91,10.38 54.23,10.38 55.92,8.69 58.63,8.69 IC3.15
ENABLE_P2D2D3  (via drill 0.35)
  Top 0.152: U1.23 42.95,12.74 44.25,11.44 47.28,11.44 47.89,10.83 48.63,10.83 v49.23,11.43 | v58.41,18.75 58.67,18.48 58.67,15.36 57.95,14.64 50.26,14.64 49.23,13.61 v49.23,13.2 | IC4.14 62.67,18.75 v61.31,18.75
  Bottom 0.152: v61.31,18.75 v58.41,18.75 | v49.23,11.43 v49.23,13.2
GND  (via drill 0.35, 3.2)
  Top 0.152: U1.28 42.88,15.24 44.4,13.73 46.36,13.73 46.89,14.26 C1.2 46.97,14.95 v47.99,14.95 | v47.53,17.23 46.95,16.65 C9.1 | C10.1 30.87,22.22 v30.92,22.26 32.16,23.5 32.16,39.87 30.1,41.92 v29.26,41.92 | Y1.2 33.9,1.97 C3.1 36.03,0.84 v35.97,0.78 | C2.1 28.66,5.48 Y1.4 | v64.25,9.16 63.18,9.16 63.12,9.21 C15.2 | v66.75,11.14 66.45,10.83 65.39,10.83 CN2.2 | v69.54,6.26 69.23,6.57 68.18,6.57 CN3.4 CN3.3 CN3.2 CN3.1 | IC3.9 57.92,4.72 57.76,4.89 v57.3,4.89 | IC3.8 52.8,4.74 | 51.73,11.63 v52.02,11.34 | CN2.4 CN2.3 CN2.2 | CN2.2 CN2.1 | CN4.4 CN4.3 CN4.2 | CN4.2 CN4.1 | CN4.2 70.59,23.67 v70.87,23.94 | CN1.4 CN1.3 CN1.2 CN1.1 66.25,1.05 v66.74,1.54 | IC1.4 54.89,3.23 v54.1,2.44
  Top 0.203: U1.31 43.01,16.74 43.9,15.86 45.48,15.86 C9.1
  Top 0.254: U1.12 38.25,6.24 | 39.39,3.32 C11.1 | 43.41,3.32 v43.41,3.37 | U1.18 43.05,10.24 43.26,10.03 43.26,8.85 44.2,7.91 C4.1 44.58,7.94 v45.55,7.94
  Top 0.305: U1.47 33.25,20.08 32.12,21.21 C10.1 | 39.39,3.32 39.35,3.37 39.35,5.13 38.25,6.24 | C11.1 C12.1 43.41,3.32 | U1.63 29.39,10.24 C8.1 v27.8,9.85 | C16.1 48.31,8.39 v48.01,8.7 | v55.67,15.51 55.7,15.47 IC4.8 | 52.8,4.74 v51.66,4.74 | IC2.4 51.73,11.63 | v57.95,11.6 57.91,11.63 C13.2
  Top 0.508: C7.1 59.82,30.49 | 59.82,30.49 v60.71,30.49 | C6.1 60.88,34.38 v60.96,34.3 | U2.1 56.86,30.49 59.82,30.49 | J6.9 79.95,23.73 v80.01,23.79 | v79.86,44.06 v79.85,44.05 J6.1 v75.29,44.05 v75.29,44.06 | C2.1 28.51,6.52 27.89,7.14 v27.89,7.48 | v89.61,5.8 90.41,6.6 J10.17 | J10.18 90.41,44.7 v90.53,44.82 | v42.35,19.06 v40.82,19.06 | J11.18 9.59,16.31 v9.6,16.32 | J11.17 9.59,33.7 v9.6,33.69 | v19.51,9.77 19.24,10.03 R2.1 | J11.1 18.73,12.68 v19.66,11.75 | J11.9 19.29,28.43 v19.81,27.9 | J7.1 22.54,7.31 v22.55,7.33 | J7.9 19.55,26.27 v19.51,26.23 | v13.72,43.6 13.7,43.62 J1.5 13.7,46.48 v13.72,46.49 | C5.2 54.22,18.33 v53.3,18.33
  Top 0.61: v84.28,37.35 84.25,37.33 J10.1 81.2,37.33 81.08,37.45 v81.08,38.27 | v83.82,21.65 83.74,21.57 J10.9 80.09,21.57 v80.01,21.65 | J5.5 62.44,23.7
  other vias: 4,46 4,4 96,46 96,4 62.97,14.84 38.69,16.32 48.31,3.51 61.6,14.84 60.23,9.96 57.94,9.96 60.08,14.84 69.68,14.23 69.53,20.93 69.83,16.51 65.11,22.15 15.39,15.41 15.39,12.36 86.14,36.02 84.46,18.95 99.09,24.9 70.9,0.66 1.07,25.01 50.75,36.74 42.98,21.65 34.73,21.04 18.29,41.77 13.26,14.03 83.39,46.23 25.76,47.26 45.26,25.92 47.24,27.44 50.75,35.67 47.24,30.8 47.7,21.65 55.78,24.85 35.19,15.71 33.97,15.71 32.44,15.71
  pour Bottom: 0,50 100,50 100,0 0,0
  pour Top (no thermals): 92.05,43.75 92.05,41.01 88.85,41.01 88.85,43.75
  pour Top (isolate 0.254, no thermals): 92.05,9 92.05,6.26 88.85,6.26 88.85,9
  pour Top (no thermals): 11.13,41.01 8.08,41.01 8.08,44.06 11.13,44.06
  pour Top (no thermals): 11.13,5.96 8.08,5.96 8.08,9 11.13,9
  pour Top (isolate 0.254, rank 5): 0,0 0,50 100,50 100,0
I2C_SCL  (via drill 0.35)
  Top 0.152: U1.61 31.53,11.24 31.98,11.7 31.98,14.34 32.59,14.95 38.64,14.95 v39.6,15.91 | R1.1 45.86,27.53 J5.3 45.84,24.66 45.11,23.93 45.11,21.34 44.5,20.73 42.06,20.73 v41.91,20.88
  Bottom 0.152: v39.6,15.91 39.6,16.02 39.91,16.32 39.91,16.93 41.43,18.45 41.43,20.4 v41.91,20.88
I2C_SDA  (via drill 0.35)
  Top 0.152: v40.01,15.3 39.86,15.45 39.05,14.64 32.72,14.64 32.29,14.21 32.29,11.44 31.59,10.74 U1.62 | R3.1 51.27,27.68 J5.2 51.27,20.65 50.29,19.67 43.73,19.67 v43.42,19.98 v43.41,19.98
  Bottom 0.152: v40.01,15.3 40.22,15.51 40.22,16.78 41.74,18.3 41.74,19.67 42.04,19.98 v43.41,19.98
N$1
  Top 0.508: J1.1 16.3,46.03 16.61,46.34 19.2,46.34 21.03,48.17 24.5,48.17 D3.A
N$4
  Top 0.152: IC2.1 51.35,13.59 53.85,11.09 54.49,11.09 54.74,10.83 58.06,10.83 58.52,11.29 58.52,12.34 58.83,12.65 RN2.2 60.06,12.65 60.32,12.91 60.32,13.83 60.47,13.98 62.39,13.98 62.94,13.42 62.94,12.66 63.2,12.4 CN2.6 64.36,12.4 64.47,12.51 64.47,13.42 64.77,13.73 66.9,13.73 67.06,13.58 67.06,12.78 67.43,12.4 RN5.6
N$5
  Top 0.152: Y1.1 34,3.72 C3.2 35.25,4.5 U1.6
N$6
  Top 0.152: IC2.6 55.71,12.29 55.93,12.51 58.23,12.51 59.17,13.45 RN2.1 59.45,14.02 59.71,14.28 63.03,14.28 63.28,14.03 63.7,14.03 | RN5.5 68.16,13.26 68.16,13.54 67.67,14.03 63.7,14.03 | 63.7,14.03 63.69,14.02 CN2.5
N$8
  Top 0.152: RN5.8 67.78,10.8 67.21,10.22 64.62,10.22 64.04,10.8 CN2.8 63.39,10.8 63.06,10.47 60.17,10.47 59.59,11.05 RN2.4 59.21,11.05 58.67,10.52 54.62,10.52 54.61,10.53 54.39,10.75 53.63,10.75 52.1,12.29 IC2.3
N$9
  Top 0.152: IC3.11 59.3,6.03 59.37,6.1 RN3.3
N$10
  Top 0.152: RN3.4 59.37,5.3 59.3,5.38 IC3.10
N$11
  Top 0.152: IC4.12 63.9,17.43 64.31,17.01 RN7.2
N$12
  Top 0.152: IC4.13 64.11,18.07 64.37,17.81 RN7.1
N$16
  Top 0.152: IC1.1 57.04,1.27 57.62,1.85 RN1.3 59.12,1.85 59.59,1.38 59.59,0.62 59.74,0.47 62.79,0.47 | 62.79,0.47 66.43,0.47 67.81,1.85 RN4.7 | 62.79,0.47 62.79,1.69 62.95,1.85 CN1.7
N$17
  Top 0.152: RN4.5 68.13,3.7 67.55,4.28 63.7,4.28 | 63.7,4.28 59.49,4.28 58.72,3.5 RN1.1 56.43,3.45 56.06,3.82 54.9,3.82 54.11,3.03 52.35,3.03 51.89,2.58 IC1.6 | CN1.5 63.69,4.27 63.7,4.28
N$18
  Top 0.152: IC1.3 55.46,2.65 RN1.2 59.02,2.65 59.59,3.21 59.59,3.87 59.7,3.98 62.48,3.98 62.79,3.67 62.79,2.91 63.02,2.67 63.67,2.67 CN1.6 64.05,2.65 64.47,3.06 64.47,3.67 64.77,3.98 66.28,3.98 67.04,3.21 67.04,2.76 67.15,2.65 RN4.6
NRST  (via drill 0.35)
  Top 0.152: v43.74,46.19 43.45,46.19 40.08,42.81 33.6,42.81 30.09,46.32 J12.5 | U1.7 35.75,12.26 v34.59,13.41 | v44.65,43.75 45.1,43.75 46.48,42.37 46.48,41 40.84,35.36 40.84,32.5 38.39,30.05 36.16,30.05 34.79,28.68 34.79,22.25 36.27,20.77 v36.27,20.42
  Bottom 0.152: v44.65,43.75 44.92,44.02 J3.5 44.7,46.19 v43.74,46.19 | v36.27,20.42 36.27,18.57 35.99,18.29 35.05,18.29 34.59,17.83 v34.59,13.41
P1_CLOCK
  Top 0.152: J10.16 80.47,11.19 80.47,8.09 78.33,5.95 J6.16 71.94,5.95 69.73,3.74 RN4.4
P1_CLOCK_3V
  Top 0.152: U1.8 36.25,6.19 37.93,4.51 37.93,2.68 40.14,0.47 53.03,0.47 54.49,1.93 IC1.2
P1_D0
  Top 0.152: RN3.6 64.28,6.1 64.84,6.66 CN3.7 67.04,6.66 67.4,7.02 67.4,8.7 67.71,9 71.14,9 72.24,10.1 72.24,13.02 74.54,15.32 J6.12 78.58,16.11 80.24,17.77 J10.12
P1_D0_3V
  Top 0.152: U1.11 37.75,5.98 38.84,4.89 38.84,3.06 39.45,2.45 43.43,2.45 44.5,3.52 47.05,3.52 48.8,5.27 50.75,5.27 51.5,6.03 IC3.6
P1_D1
  Top 0.152: RN3.5 64.28,5.3 64.84,5.86 CN3.8 66.78,5.86 67.75,4.89 69.51,4.89 72.54,7.92 72.54,12.81 73.3,13.57 J6.13 80.39,16.5 J10.13
P1_D1_3V
  Top 0.152: U1.10 37.25,6.05 38.54,4.76 38.54,2.94 39.33,2.15 43.56,2.15 44.63,3.21 47.18,3.21 48.93,4.97 50.87,4.97 51.28,5.38 IC3.7
P1_D2
  Top 0.152: 77.42,18.65 74.11,18.65 72.54,17.08 72.54,13.76 71.93,13.14 71.93,10.22 71.02,9.31 65.74,9.31 64.13,7.7 RN3.8 | 77.42,18.65 J6.11 | 77.42,18.65 77.8,19.04 J10.11 82.93,19.04 83.97,18 83.97,11.14 77.86,5.03 71.48,5.03 70.48,4.04 70.48,2.9 70.23,2.65 RN4.3 | IC3.13 59.3,7.33 60.96,7.33 61.33,7.7 RN3.1
  Top 0.203: RN3.1 RN3.8
P1_D2_3V_IN  (via drill 0.35)
  Top 0.152: U1.24 42.88,13.24 44.38,11.75 47.4,11.75 47.71,11.44 48.11,11.44 v48.16,11.39 | v48.16,9.46 48.46,9.77 53.98,9.77 54.86,8.88 54.86,4.22 54.02,3.38 51.59,3.38 IC1.5
  Bottom 0.152: v48.16,11.39 v48.16,9.46
P1_D2_3V_OUT
  Top 0.152: U1.15 39.75,6.73 40.06,6.41 43.08,6.41 45.37,4.13 46.8,4.13 48.55,5.88 50.49,5.88 51.74,7.13 52.62,7.13 IC3.4
P1_D3
  Top 0.152: 62.64,6.57 62.64,4.74 62.79,4.58 69.66,4.58 73.56,8.49 J6.15 78.53,8.49 79.86,9.82 79.86,13.42 80.39,13.96 J10.15 | RN3.2 61.54,6.67 IC3.12
  Top 0.203: RN3.7 62.64,6.9 | 62.64,6.9 RN3.2 | 62.64,6.57 62.64,6.9
P1_D3_3V
  Top 0.152: U1.14 39.25,6.73 39.87,6.11 42.96,6.11 45.24,3.82 46.93,3.82 48.68,5.58 50.62,5.58 51.72,6.67 IC3.5
P1_LATCH
  Top 0.152: RN4.2 69.17,1.85 68.87,2.15 68.87,3.8 69.19,4.12 69.65,4.12 72.69,7.16 79.08,7.16 80.16,8.24 80.16,12.97 80.47,13.27 83.36,13.27 83.67,13.58 83.67,14.49 82.93,15.22 J10.14 80.59,15.22 79.55,14.19 79.55,12.51 78.07,11.03 J6.14
P1_LATCH_3V
  Top 0.152: U1.9 36.75,6.12 38.23,4.64 38.23,2.81 40.27,0.78 52.29,0.78 52.58,1.07 52.58,1.68 52.33,1.93 IC1.7
P1_VCC  (via drill 0.35)
  Top 0.152: RN1.8 RN1.7 | RN1.7 RN1.6 RN1.5 | v61.73,3.12 61.26,2.65 RN1.7
  Top 0.203: C15.1 62.27,10.14 63.94,10.14 64.29,9.79 70.59,9.79 71.48,10.68 71.48,13.27 72.08,13.88 72.08,19.82 73.45,21.19 J6.10
  Top 0.305: v56.24,7.79 56.24,4.74 57.01,3.96 v57.76,3.96
  Top 0.508: 75.6,21.19 J6.10 | C15.1 61.35,9.28 IC3.16 56.27,9.28 v56.24,9.31
  Top 0.813: D1.A 85.41,47.35 87.33,45.43 87.33,23.02 84.61,20.3 J10.10 76.48,20.3 75.6,21.19
  Bottom 0.305: v56.24,9.31 v56.24,7.79 | v61.73,3.12 58.6,3.12 v57.76,3.96
P2_CLOCK
  Top 0.152: J10.8 80.54,28.43 78.38,26.27 J6.8 73.51,26.27 72.69,25.45 72.69,22.87 71.63,21.81 71.63,14.42 71.02,13.81 71.02,10.99 70.26,10.22 69.19,10.22 68.89,10.53 68.89,12.97 69.12,13.2 RN5.4
P2_CLOCK_3V
  Top 0.152: U1.25 42.88,13.74 44.57,12.05 49.44,12.05 50.32,12.94 IC2.2
P2_D0
  Top 0.152: J6.4 78.19,36.43 79.86,34.76 79.86,34.15 80.49,33.52 J10.4 82.93,33.52 83.67,32.78 83.67,31.86 83.36,31.56 79.86,31.56 78.79,32.63 72.69,32.63 72.39,32.32 72.39,28.33 71.48,27.41 71.48,23.47 70.87,22.86 68.73,22.86 68.4,22.53 CN4.6 68.4,17.37 68.04,17.01 RN7.7
P2_D0_3V
  Top 0.152: U1.39 37.25,18.42 38.13,17.54 40.82,17.54 41.19,17.91 42.88,17.91 43.11,18.15 48.5,18.15 49.42,17.22 55.69,17.22 55.9,17.43 IC4.5
P2_D1
  Top 0.152: J10.5 80.09,32.24 78.44,33.89 J6.5 73.5,33.89 72.08,32.47 72.08,28.45 71.17,27.54 71.17,25.45 70.56,24.84 67.51,24.84 67.06,24.38 67.06,22.71 67.6,22.16 CN4.5 67.6,21.52 68.06,21.06 68.06,17.99 67.88,17.81 RN7.8
P2_D1_3V
  Top 0.152: IC4.4 56.04,18.07 55.49,17.53 49.55,17.53 48.62,18.45 42.98,18.45 42.75,18.22 41.07,18.22 40.69,17.84 38.26,17.84 37.75,18.35 U1.38
P2_D2  (via drill 0.35)
  Top 0.152: J6.3 77.46,37.92 80.59,34.78 J10.3 82.88,34.78 84.28,33.39 84.28,29.88 83.52,29.12 80.62,29.12 78.94,27.45 72.83,27.45 72.39,27.01 72.39,23 71.32,21.93 71.32,14.85 70.92,14.44 | RN5.1 69.78,10.88 70.15,10.88 70.71,11.44 70.71,14.24 70.92,14.44 | v69.8,15.61 69.6,15.4 68.96,15.4 68.15,16.21 RN7.6 RN7.3 64.35,16.21 63.79,16.77 IC4.11 | v70.9,14.56 70.92,14.54 70.92,14.44
  Bottom 0.152: v69.8,15.61 70.85,14.56 v70.9,14.56
P2_D2_3V_IN  (via drill 0.35)
  Top 0.152: IC2.5 54.37,11.63 51.82,14.19 50.3,14.19 49.84,13.72 49.84,12.95 49.24,12.36 44.98,12.36 v44.74,12.6 | U1.40 36.73,19.15 36.73,18.49 37.99,17.23 39.17,17.23 40.54,15.86 40.54,12.81 v40.39,12.66
  Bottom 0.152: v44.74,12.6 40.45,12.6 v40.39,12.66
P2_D2_3V_OUT
  Top 0.152: U1.29 42.95,15.74 43.43,15.25 43.43,15.12 44.52,14.03 45.87,14.03 46.02,14.19 46.02,15.56 46.18,15.71 47.02,15.71 48.23,16.92 55.6,16.92 55.74,16.77 IC4.6
P2_D3
  Top 0.152: J10.7 79.53,29.7 78.63,28.81 J6.7 73.3,28.81 71.78,27.29 71.78,23.25 70.71,22.18 70.71,15.56 70.26,15.1 68.25,15.1 67.94,15.41 RN7.5 RN7.4 64.39,15.41 63.68,16.12 IC4.10
P2_D3_3V
  Top 0.152: U1.27 42.95,14.74 44.27,13.42 46.49,13.42 46.79,13.72 47.93,13.72 48.95,14.74 48.95,16.18 49.38,16.61 55.41,16.61 55.9,16.12 IC4.7
P2_LATCH  (via drill 0.35)
  Top 0.152: J10.6 74.92,30.98 J6.6 74.98,30.91 74.98,29.58 v74.83,29.43 | v74.83,28.21 73.16,28.21 72.08,27.14 72.08,23.12 71.32,22.36 71.02,22.06 71.02,15.43 70.4,14.81 70.4,12.8 69.99,12.4 RN5.3
  Bottom 0.152: v74.83,29.43 v74.83,28.21
P2_LATCH_3V
  Top 0.152: U1.37 38.25,18.44 38.54,18.15 40.56,18.15 40.94,18.52 42.62,18.52 42.86,18.76 52.12,18.76 52.88,19.52 52.88,20.85 53.83,21.79 56.95,21.79 58.98,19.77 58.98,15.13 58.19,14.34 54.16,14.34 53.85,14.03 53.85,13.26 54.18,12.94 IC2.7
P2_VCC  (via drill 0.35)
  Top 0.152: RN2.8 RN2.7 RN2.6 | RN2.6 RN2.5 | v62.34,13.29 61.05,13.29 RN2.6
  Top 0.406: C17.1 64.4,19.24 63.61,20.02
  Top 0.508: v61.36,15.64 60.09,16.92 60.09,19.51 60.6,20.02 IC4.16 63.61,20.02
  Top 0.61: C17.1 65.6,19.24 66.37,20.01
  Top 0.813: D2.A 85.8,43.95 85.8,37.2 84.66,36.05 J10.2 80.54,36.05 79.86,36.74 79.86,40.7 79.05,41.51 J6.2 74.52,41.49 74.52,40.25 71.32,37.05 71.32,30.63 70.71,30.02 66.9,30.02 66.37,29.49 66.37,20.01
  Bottom 0.305: v62.34,13.29 62.34,15.27 61.82,15.8 61.52,15.8 v61.36,15.64
SNES_RESET
  Top 0.152: J4.1 59.1,42.72 57.15,44.67 43.43,44.67 40.54,41.77 40.54,32.63 38.26,30.35 35.98,30.35 34.48,28.86 34.48,22.09 35.75,20.83 U1.42
SWCLK  (via drill 0.35)
  Top 0.152: U1.49 31.55,17.24 32.32,16.47 35.64,16.47 36.71,17.54 v36.86,17.54 | v51.36,43.75 50.11,43.75 41.45,35.09 41.45,32.21 38.68,29.44 36.44,29.44 35.4,28.4 35.4,22.52 36.88,21.04 37.24,21.04 v37.85,20.43 | v52.58,48.02 51.99,48.6 45.01,48.6 39.82,43.42 34.01,43.42 32.61,44.82 v32.61,46.8
  Bottom 0.152: v51.36,43.75 52.54,44.93 J3.2 52.54,47.98 v52.58,48.02 | v32.61,46.8 v32.61,46.81 32.63,46.83 J12.2 | 37.8,20.49 v37.85,20.43 36.88,19.46 36.88,17.56 v36.86,17.54
SWDIO  (via drill 0.35)
  Top 0.152: U1.46 33.75,18.36 34.46,17.66 v35.19,17.66 | v47.55,43.75 47.55,41.62 41.15,35.22 41.15,32.33 38.56,29.74 36.28,29.74 35.09,28.55 35.09,22.37 v37.03,20.43 | v30.79,46.49 30.79,46.19 33.86,43.12 39.95,43.12 45.13,48.3 47.12,48.3 v47.4,48.02
  Bottom 0.152: v47.55,43.75 47.46,43.84 J3.4 47.46,47.95 v47.4,48.02 | J12.4 30.09,47.19 v30.79,46.49 | v37.03,20.43 36.58,19.98 36.58,18.44 36.1,17.96 35.49,17.96 v35.19,17.66
SWITCH1  (1 unrouted)
  Top 0.152: U1.33 40.25,19.69 40.39,19.82 42.37,19.82 43.13,19.06 51.97,19.06 52.58,19.67 52.58,21 53.69,22.11 57,22.11 57.61,22.72 57.61,26.96 58.37,27.72 62.74,27.72 62.75,27.74 S1.2
SWITCH2  (1 unrouted)
  Top 0.152: U1.34 39.75,19.97 40.06,20.28 42.35,20.28 43.26,19.37 51.82,19.37 52.27,19.82 52.27,21.15 53.53,22.42 56.88,22.42 57.3,22.84 57.3,27.14 58.19,28.03 60.78,28.03 64.48,31.73 64.48,33.83 63.56,34.75 S2.2
SWITCH3  (1 unrouted)
  Top 0.152: 30.71,25.67 29.72,24.68 29.72,18.63 30.51,17.84 31.68,17.84 32.75,16.78 35.46,16.78 36.27,17.58 36.27,19.15 U1.41 | 30.71,25.67 30.75,25.71 | 30.71,25.67 30.71,27.71 S3.2
SWITCH4  (1 unrouted)
  Top 0.152: U1.43 35.25,18.41 35.71,17.95 35.71,17.45 35.34,17.08 32.87,17.08 31.81,18.15 30.63,18.15 30.02,18.76 30.02,24.55 31.85,26.38 31.85,33.53 30.75,34.63 S4.2
USBHS_DM
  Top 0.254: J2.2 49.85,37.35 49.07,37.35 42.32,30.59 42.32,22.22 40.83,20.74 40,20.74 39.25,19.99 U1.35
USBHS_DP
  Top 0.254: U1.36 38.75,20.06 39.83,21.15 40.66,21.15 41.91,22.39 41.91,30.76 48.94,37.79 48.94,38.44 J2.3
V1_CLOCK
  Top 0.152: U1.56 29.96,13.74 27.58,16.12 27.58,22.72 26.57,23.73 J7.8 20.2,23.73 J11.8
V1_D0
  Top 0.152: U1.59 27.85,12.24 26.52,13.57 J7.4 22.26,13.57 20.42,15.4 20.42,16.02 19.95,16.48 J11.4
V1_D1
  Top 0.152: J11.5 19.75,17.75 21.39,16.11 J7.5 26.73,16.11 30.1,12.74 U1.58
V1_D2
  Top 0.152: J11.3 19.7,15.21 22.54,12.37 J7.3
V1_D3
  Top 0.152: J11.7 19.21,20.3 20.11,21.19 J7.7
V1_LATCH
  Top 0.152: U1.57 30.03,13.24 27.01,16.26 27.01,18.15 26.51,18.65 J7.6 25.09,19.02 J11.6
V2_CLOCK
  Top 0.152: U1.50 29.75,16.74 29.41,17.08 29.41,38.57 25.46,42.52 J7.16 22.24,44.05 18.04,39.85 J11.16
V2_D0
  Top 0.152: U1.53 29.75,15.24 28.5,16.5 28.5,33.24 27.84,33.89 J7.12 20.62,33.89 18.96,32.23 J11.12
V2_D1
  Top 0.152: U1.52 29.75,15.74 28.8,16.69 28.8,35.83 28.2,36.43 J7.13 21.93,36.43 19,33.51 J11.13
V2_D2
  Top 0.152: J11.11 22.16,30.96 J7.11 27.03,31.35 27.89,30.49 27.89,16.25 29.89,14.24 U1.55
V2_D3
  Top 0.152: J7.15 21.53,41.51 19.96,39.94 19.96,36.59 19.42,36.05 J11.15 16.98,36.05 16,35.06 16,32.17 16.61,31.56 19.66,31.56 20.88,32.78 26.67,32.78 28.19,31.25 28.19,16.37 29.82,14.74 U1.54
V2_LATCH
  Top 0.152: U1.51 29.75,16.24 29.11,16.89 29.11,38.42 28.56,38.97 J7.14 21.43,38.97 20.27,37.81 20.27,35.98 19.07,34.77 J11.14
V+  (via drill 0.35)  (1 unrouted)
  Top 0.152: U1.48 32.61,19.31 | C10.2 31.02,19.31 | U1.64 30.13,9.74 | 29,8.15 C8.2 | 56.49,13.59 C13.1
  Top 0.254: U1.13 38.75,6.51 | 40.18,5.07 C11.2 | 43.23,5.07 v43.26,5.04 | U1.19 43.12,10.74 44.2,9.66 C4.2 | U1.1 32.75,8.7 32.29,9.16
  Top 0.305: 32.61,19.31 31.02,19.31 | 38.75,6.51 40.18,5.07 | C11.2 C12.2 43.23,5.07 | 30.13,9.74 29.85,9.46 29.85,9 29,8.15 | C10.2 31.03,19.46 32.65,17.84 v33.2,17.84 | C9.2 43.93,17.24 U1.32 41.31,17.24 41,16.93 41,11.44 39.79,10.24 | C13.1 57.97,13.38 59.4,14.82 59.4,20.27 v58.48,21.2 58.33,21.2 58.1,21.43 58.1,26.41 v58.37,26.68 | C16.2 50.56,7.9
  Top 0.406: C16.2 51.44,9.28 IC3.1 53.82,9.28 54.25,8.84 54.25,4.43 | 55.59,20.02 IC4.1 | C5.1 54.87,20.02
  Top 0.508: C7.2 60.7,32.13 61.57,31.25 61.57,29.58 60.5,28.51 56.69,28.51 | v54.86,43.6 52.27,41.01 52.27,36.44 53.8,34.91 53.8,32.75 | v55.02,48.02 53.95,49.09 44.81,49.09 39.62,43.9 34.29,43.9 33.98,44.21 v33.98,46.8 | C4.2 44.89,9.66 46.46,8.09 46.46,6.72 | v45.85,5.04 46.16,5.04 46.46,5.35 46.46,6.26 | 46.46,6.72 46.46,6.26 | 46.46,6.72 44.02,6.72 43.54,7.2 42.84,7.2 39.79,10.24 35.9,14.14 v33.2,14.14 33.2,10.07 32.29,9.16 31.23,8.1 C8.2 | 29,8.15 28.89,8.15 28.56,8.49 J7.2 25.46,5.36 22.61,2.51 J13.1 16.04,2.51 14.33,4.23 14.33,13.95 | J11.2 14.33,13.95 | J7.10 24.39,28.81 23.5,29.7 J11.10 15.81,29.7 14.33,28.21 14.33,13.95 | 56.69,28.51 v56.69,26.68 | v45.25,17.5 45.25,17.37 C9.2 | 54.25,4.43 53.8,3.98 50.76,3.98 50.44,3.66 50.44,2.44 49.48,1.47 49.48,1.63 C14.2 49.83,1.27 IC1.8 | IC2.8 56.49,13.59 | 50.56,7.9 49.99,7.33 v48.77,7.33 | v47.7,6.26 46.46,6.26 | C5.1 55.32,21.18 | 56.69,28.51 54.27,28.51 53.81,28.05 J5.1 | 54.87,20.02 55.59,20.02 | U2.4 50.61,32.17 48.7,30.26 R3.2 47.62,29.43 R1.2 44.52,29.43 43.89,28.8 43.89,21.37 v43.87,21.35
  Top 0.61: C7.2 59.08,32.75 U2.2 53.8,32.75 U2.4
  Bottom 0.152: J12.1 33.91,46.88 v33.98,46.8
  Bottom 0.305: v58.37,26.68 v56.69,26.68
  Bottom 0.508: v54.86,43.6 55.08,43.81 J3.1 55.08,47.95 v55.02,48.02 | v45.25,17.5 44.79,17.96 44.79,20.43 v43.87,21.35 | v45.85,5.04 v43.26,5.04 | v33.2,17.84 v33.2,14.14 | v48.77,7.33 v47.7,6.26 | v58.48,21.2 56.81,21.2 v56.8,21.18
  pour Top: 57.91,28.51 56.69,27.29 55.47,28.51
  pour Top: 14.33,15.25 15.62,13.96 14.33,12.66
  pour Top: 52.58,32.77 53.8,33.99 55.02,32.77
VCAP
  Top 0.152: U1.30 42.91,16.24 44.28,14.87 C1.1
XTAL1
  Top 0.152: Y1.3 27.65,1.62 30.11,4.08 30.11,6.21 C2.2 34.38,6.52 34.75,6.89 U1.5

### Text on the board
tNames: CK | GD | EX2 | D3 | VC | P2 | LA | D2 | D1 | D0 | D0 | D1 | VC | D2 | D3 | LA | CK | GD | GD | CK | LA | D3 | D2 | VC | D1 | D0 | D0 | D1 | D2 | LA | VC | D3 | EX1 | P1 | GD | CK | DFU | TAStm32 | v4 rev3
bNames: RST | IO | GND | CLK | V+ | github:Ownasaurus/TAStm32 | design - rasteri / Ownasaurus